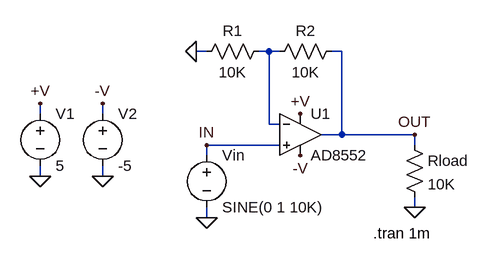
[diagram p0: schematic AD8552.asc]
AD8552.asc, the LTspice schematic file:
Version 4
SHEET 1 1240 700
WIRE 240 -992 224 -992
WIRE 336 -992 320 -992
WIRE 352 -992 336 -992
WIRE 448 -992 432 -992
WIRE -16 -896 -16 -912
WIRE 80 -896 80 -912
WIRE 336 -880 336 -992
WIRE 352 -880 336 -880
WIRE 448 -864 448 -992
WIRE 448 -864 416 -864
WIRE 560 -864 448 -864
WIRE 352 -848 240 -848
WIRE 560 -848 560 -864
WIRE 240 -832 240 -848
WIRE -16 -800 -16 -816
WIRE 80 -800 80 -816
WIRE 560 -752 560 -768
WIRE 240 -736 240 -752
FLAG -16 -912 +V
FLAG -16 -800 0
FLAG 240 -736 0
FLAG 560 -864 OUT
FLAG 240 -848 IN
FLAG 384 -896 +V
FLAG 80 -912 -V
FLAG 384 -832 -V
FLAG 224 -992 0
FLAG 560 -752 0
FLAG 80 -800 0
SYMBOL Opamps\\AD8552 384 -928 R0
SYMATTR InstName U1
SYMBOL voltage -16 -912 R0
WINDOW 123 0 0 Left 2
WINDOW 39 0 0 Left 2
SYMATTR InstName V1
SYMATTR Value 5
SYMBOL voltage 240 -848 R0
WINDOW 123 24 146 Left 2
WINDOW 39 24 125 Left 2
SYMATTR InstName Vin
SYMATTR Value SINE(0 1 10K)
SYMBOL res 336 -1008 R90
WINDOW 0 0 56 VBottom 2
WINDOW 3 32 56 VTop 2
SYMATTR InstName R1
SYMATTR Value 10K
SYMBOL res 448 -1008 R90
WINDOW 0 0 56 VBottom 2
WINDOW 3 32 56 VTop 2
SYMATTR InstName R2
SYMATTR Value 10K
SYMBOL voltage 80 -912 R0
WINDOW 123 24 146 Left 2
WINDOW 39 24 125 Left 2
SYMATTR InstName V2
SYMATTR Value -5
SYMBOL res 544 -864 R0
SYMATTR InstName Rload
SYMATTR Value 10K
TEXT 496 -712 Left 2 !.tran 1m

The netlist it stands for:
* AD8552.asc
XU1 IN N001 +V -V OUT AD8552  ; pins In+ In- V+ V- OUT
V1 +V 0 5
Vin IN 0 SINE(0 1 10K)
R1 N001 0 10K
R2 OUT N001 10K
V2 -V 0 -5
Rload OUT 0 10K
.tran 1m
.backanno
.end